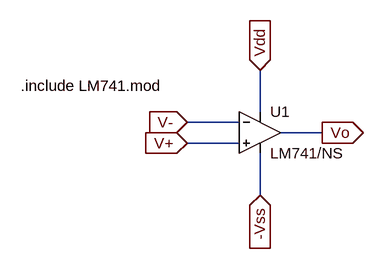
[diagram p0: schematic IC741.asc]
IC741.asc, the LTspice schematic file:
Version 4
SHEET 1 880 680
WIRE 368 128 368 64
WIRE 336 144 256 144
WIRE 464 160 400 160
WIRE 336 176 256 176
WIRE 368 256 368 192
FLAG 464 160 Vo
IOPIN 464 160 Out
FLAG 368 64 Vdd
IOPIN 368 64 In
FLAG 368 256 -Vss
IOPIN 368 256 In
FLAG 256 176 V+
IOPIN 256 176 In
FLAG 256 144 V-
IOPIN 256 144 In
SYMBOL OpAmps\\opamp2 368 96 R0
SYMATTR InstName U1
SYMATTR Value LM741/NS
TEXT 0 88 Left 2 !.include LM741.mod

The netlist it stands for:
* IC741.asc
XU1 V+ V- Vdd -Vss Vo LM741/NS  ; pins In+ In- V+ V- OUT
.include LM741.mod
.backanno
.end